# Altium schematic sheet BlueTooth.SchDoc: BlueTooth.SchDoc
size A4; CheckedBy: fx; Author: flotox@yeah.net; Revision: v1.0.0; SheetNumber: 3; SheetTotal: 10
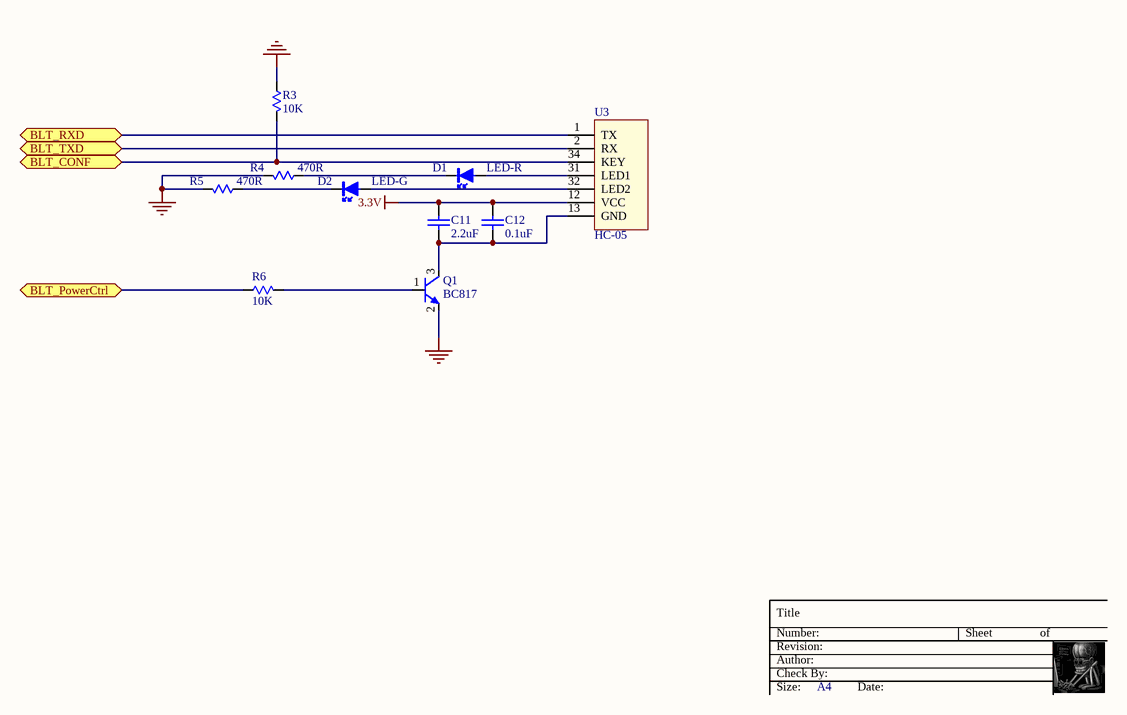
[diagram p0: BlueTooth.SchDoc]

## Parts
C11  2.2uF  [C0603-S]
C12  0.1uF  [C0603-S]
D1  LED-R  [LED0603]
D2  LED-G  [LED0603]
Q1  BC817  [SOT-23]
R3  10K  [R0603-S]
R4  470R  [R0603-S]
R5  470R  [R0603-S]
R6  10K  [R0603-S]
U3  HC-05  [HC-05]

## Ports
BLT_CONF, BLT_PowerCtrl, BLT_RXD, BLT_TXD

## Nets
3.3V: C11.2 C12.2 U3.12(VCC)
GND: Q1.2(E) R3.2 R4.1 R5.1
BLT_CONF: R3.1 U3.34(KEY) ; port BLT_CONF
BLT_PowerCtrl: R6.2 ; port BLT_PowerCtrl
BLT_RXD: U3.1(TX) ; port BLT_RXD
BLT_TXD: U3.2(RX) ; port BLT_TXD
NetC11_1: C11.1 C12.1 Q1.3(C) U3.13(GND)
NetD1_1: D1.1(A) U3.31(LED1)
NetD1_2: D1.2(K) R4.2
NetD2_1: D2.1(A) U3.32(LED2)
NetD2_2: D2.2(K) R5.2
NetQ1_1: Q1.1(B) R6.1

## Notes on the sheet
- Title
- Revision:
- Number:
- Author:
- Check By:
- Sheet
- of
- Size:
- A4
- Date:

## Library data of the parts
C11 C12 = CAP: Capacitor
D1 D2 = LED: Light Emitting Diode
Q1 = NPN: NPN General Purpose Amplifier
R3-R6 = RES: Resistor
U3 = HC-05: Bluetooth Module